# Altium schematic sheet sb-sonata-psu.SchDoc: Switch-mode PSU
size Letter; Organization: NewAE Technology Inc.; Address1: 1083 Queen St., Suite 196; Address2: Halifax; Address3: NS; Address4: Canada B3H 0B2; SheetNumber: 17; SheetTotal: 20; SheetApproved: YES
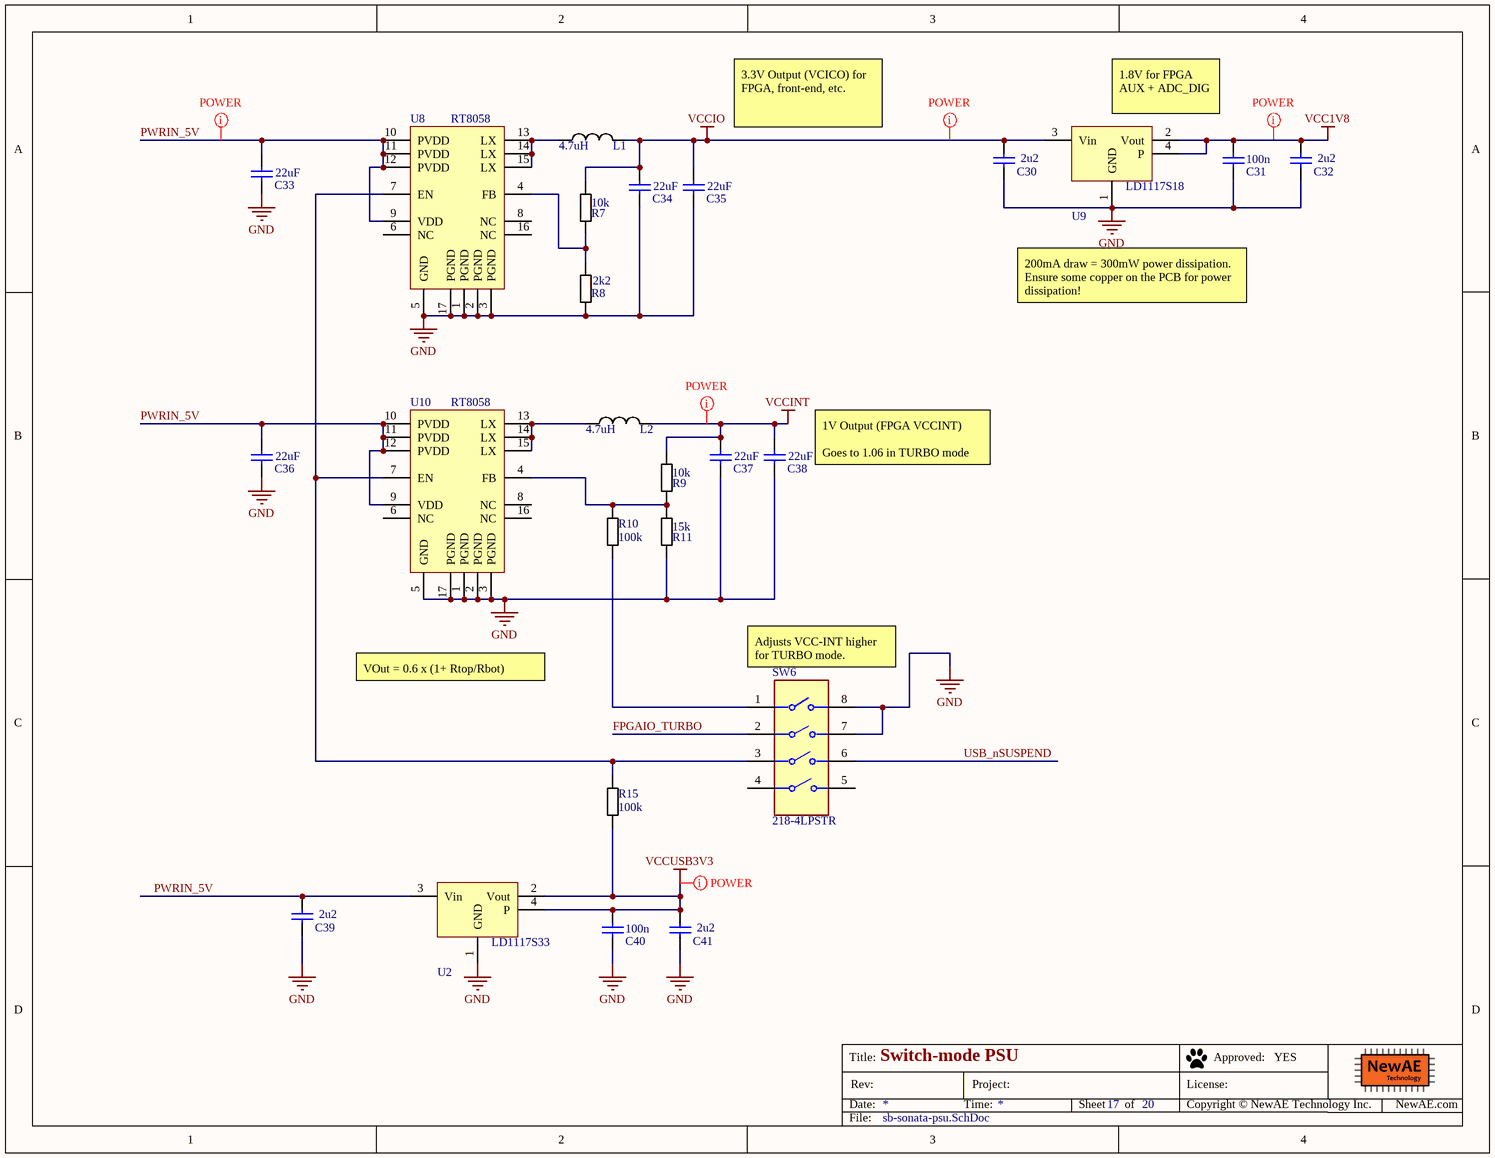
[diagram p0: sb-sonata-psu.SchDoc]

## Parts
C30  2u2  [CAPC0603_M]
C31  100n  [CAPC0402_M]
C32  2u2  [CAPC0603_M]
C33  22uF  [CAPC0805_M]
C34  22uF  [CAPC0805_M]
C35  22uF  [CAPC0805_M]
C36  22uF  [CAPC0805_M]
C37  22uF  [CAPC0805_M]
C38  22uF  [CAPC0805_M]
C39  2u2  [CAPC0603_M]
C40  100n  [CAPC0402_M]
C41  2u2  [CAPC0603_M]
L1  4.7uH  [NR6028]
L2  4.7uH  [NR6028]
R7  10k  [RESC1005X40N]
R8  2k2  [RESC1005X40N]
R9  10k  [RESC1005X40N]
R10  100k  [RESC1005X40N]
R11  15k  [RESC1005X40N]
R15  100k  [RESC1608X55N]
SW6  218-4LPSTR  [FP-218-4LPSTR-MFG]
U2  LD1117S33  [SOT-223]
U8  RT8058  [QFN16_50P300X300X100_HS-17M]
U9  LD1117S18  [SOT-223]
U10  RT8058  [QFN16_50P300X300X100_HS-17M]

## Nets
GND: C30.2 C31.2 C32.2 C33.2 C34.2 C35.2 C36.2 C37.2 C38.2 C39.2 C40.2 C41.2 R8.2 R11.2 SW6.7 SW6.8 U2.1(GND) U8.1(PGND) U8.2(PGND) U8.3(PGND) U8.5(GND) U8.17(PGND) U9.1(GND) U10.1(PGND) U10.2(PGND) U10.3(PGND) U10.5(GND) U10.17(PGND)
VCC1V8: C31.1 C32.1 U9.2(Vout) U9.4(P)
VCCINT: C37.1 C38.1 L2.2 R9.1
VCCIO: C30.1 C34.1 C35.1 L1.2 R7.1 U9.3(Vin)
VCCUSB3V3: C40.1 C41.1 R15.1 U2.2(Vout) U2.4(P)
FPGAIO_TURBO: SW6.2
PWRIN_5V: C33.1 C36.1 C39.1 U2.3(Vin) U8.9(VDD) U8.10(PVDD) U8.11(PVDD) U8.12(PVDD) U10.9(VDD) U10.10(PVDD) U10.11(PVDD) U10.12(PVDD)
USB_nSUSPEND: SW6.6
NetL1_1: L1.1 U8.13(LX) U8.14(LX) U8.15(LX)
NetL2_1: L2.1 U10.13(LX) U10.14(LX) U10.15(LX)
NetR7_2: R7.2 R8.1 U8.4(FB)
NetR9_2: R9.2 R10.1 R11.1 U10.4(FB)
NetR10_2: R10.2 SW6.1
NetR15_2: R15.2 SW6.3 U8.7(EN) U10.7(EN)

Not connected (* = marked no-connect by the designer): SW6 4 5; U8 6(NC) 8(NC) 16(NC); U10 6(NC) 8(NC) 16(NC)

## Layout directives
net class Power: PWRIN_5V, VCC1V8, VCCINT, VCCIO, VCCUSB3V3

## Notes on the sheet
- 3.3V Output (VCICO) for FPGA, front-end, etc.
- 1.8V for FPGA AUX + ADC_DIG
- 200mA draw = 300mW power dissipation. Ensure some copper on the PCB for power dissipation!
- (near C38) 1V Output (FPGA VCCINT)
  Goes to 1.06 in TURBO mode
- VOut = 0.6 x (1+ Rtop/Rbot)
- (near SW6) Adjusts VCC-INT higher for TURBO mode.
- Title:
- Date:
- Rev:
- Time:
- Project:
- Sheet
- of
- License:
- Copyright © NewAE Technology Inc.
- Approved:
- NewAE.com
- File:

## Library data of the parts
C30 C32 C39 C41 = CCHIP-2u2-0603: 2u2, 0603; Manufacture 1: Samsung; Manufacture Part Number 1: CL10B225KP8NNNC; Component Group: Capacitor; Case-EIA: 0603; Case-Metric: 1608; Rated Voltage: 10VDC; Part Number: CCHIP-2u2-0603; Footprint: 0603; Pin Count: 2; Supplier 1: Digi-Key; Supplier Part Number 1: 1276-1134-2-ND; Value: 2u2; Mounting Technology: SMT; Component Kind: Standard; Component Type: Standard
C31 C40 = CCHIP-100n-0402: 100n, 0402; Component Group: Capacitor; Case-EIA: 0402; Part Number: CCHIP-100n-0402; Footprint: 0402; Pin Count: 2; Value: 100n; Mounting Technology: SMT; Component Kind: Standard; Component Type: Standard; Supplier 1: Digi-Key; Supplier Part Number 1: 445-6901-1-ND
C33-C38 = CCHIP-22u-0805-16V: 22u, 16V, 0805, Ceramic; Manufacture 1: Samsung Electro-Mechanics; Manufacture Part Number 1: CL21A226MOCLRNC; Component Group: Capacitor; Case-EIA: 0805; Case-Metric: 1608; Rated Voltage: 16VDC; Tolerance: 20%; Part Number: CCHIP-22u-0805-16V; Footprint: 0805; Pin Count: 2; Supplier 1: Digi-Key; Supplier Part Number 1: 1276-6780-1-ND; Value: 22uF; Mounting Technology: SMT; RoHS: Yes; Component Kind: Standard; Component Type: Standard
L1 L2 = NR6028T4R7M: fixed ind, ferrite, shielded; Manufacture 1: Taiyo Yuden; Component Group: Inductor; Case-Metric: 6060; Part Number: NR6028T4R7M; Footprint: SMD,6x6mm; Manufacture Part Number 1: NR6028T4R7M; Pin Count: 2; Supplier 1: Digi-Key; Supplier Part Number 1: 587-2100-1-ND; Value: 4.7uH; Mounting Technology: SMT; Component Kind: Standard; Component Type: Standard
R7 R9 = RCHIP-10K-0402: 10k res, 0402, 1%, 1/16W; Manufacture 1: Yageo; Manufacture Part Number 1: RC0402FR-0710KL; Component Group: Resistor; Case-EIA: 0402; Case-Metric: 1005; Rated Power: 0.063W; Rated Voltage: 75VDC; Part Number: RCHIP-10K-0402; Footprint: 0402; Pin Count: 2; Supplier 1: Digi-Key; Supplier Part Number 1: 311-10.0KLRCT-ND; Value: 10k; Tolerance: 1%; Mounting Technology: SMT; Temperature Range: -55C to 155C; Component Kind: Standard; Component Type: Standard
R8 = RCHIP-2K2-0402: 2k2 res, 0402, 1%, 1/16W; Manufacture 1: Yageo; Manufacture Part Number 1: RC0402FR-072K2L; Component Group: Resistor; Case-EIA: 0402; Case-Metric: 1005; Rated Power: 0.063W; Rated Voltage: 75VDC; Part Number: RCHIP-2K2-0402; Footprint: 0402; Pin Count: 2; Supplier 1: Digi-Key; Supplier Part Number 1: 311-2.20KLRCT-ND; Value: 2k2; Tolerance: 1%; Mounting Technology: SMT; Temperature Range: -55C to 155C; Component Kind: Standard; Component Type: Standard
R10 = RCHIP-100K-0402: 100k res, 0402, 1%, 1/16W; Manufacture 1: Yageo; Manufacture Part Number 1: RC0402FR-07100KL; Component Group: Resistor; Case-EIA: 0402; Case-Metric: 1005; Rated Power: 0.063W; Rated Voltage: 75VDC; Part Number: RCHIP-100K-0402; Footprint: 0402; Pin Count: 2; Supplier 1: Digi-Key; Supplier Part Number 1: 311-100KLRCT-ND; Value: 100k; Tolerance: 1%; Mounting Technology: SMT; Temperature Range: -55C to 155C; Component Kind: Standard; Component Type: Standard
R11 = RCHIP-15K-0402: 15k res, 0402, 1%, 1/16W; Manufacture 1: Yageo; Manufacture Part Number 1: RC0402FR-0715KL; Component Group: Resistor; Case-EIA: 0402; Case-Metric: 1005; Rated Power: 0.063W; Rated Voltage: 75VDC; Part Number: RCHIP-15K-0402; Footprint: 0402; Pin Count: 2; Supplier 1: Digi-Key; Supplier Part Number 1: 311-15.0KLRCT-ND; Value: 15k; Tolerance: 1%; Mounting Technology: SMT; Temperature Range: -55C to 155C; Component Kind: Standard; Component Type: Standard
R15 = RCHIP-100K-0603: 100k res, 0603, 1%, 1/10W; Manufacture 1: Yageo; Manufacture Part Number 1: RC0603FR-07100KL; Component Group: Resistor; Case-EIA: 0603; Case-Metric: 1608; Rated Power: 0.1W; Rated Voltage: 75VDC; Part Number: RCHIP-100K-0603; Footprint: 0603; Pin Count: 2; Supplier 1: Digi-Key; Supplier Part Number 1: 311-100KHRCT-ND; Value: 100k; Tolerance: 1%; Mounting Technology: SMT; Temperature Range: -55C to 155C; Component Kind: Standard; Component Type: Standard
SW6 = CMP-07018-000008-1: SWITCH SLIDE DIP SPST 25MA 24V; Number of Positions: 4; Washable: Yes; Pitch: 0.05inch; Actuator Type: Slide (Standard); Electrical Life: 1000Cycles; Current Rating: 25mA; Contact Material: Copper; Max Current Rating: 25mA; Termination: Gull Wing; Throw Configuration: SPST; Mount: Surface Mount; Radiation Hardening: No; Contact Plating: Gold; Length: 0.246inch; Depth: 8.44mm; Package Quantity: 2000; Packaging: Tape and Reel; Series: 218; Lead Free: Lead Free; Voltage Rating (DC): 24V; Min Operating Temperature: -55°C; RoHS Compliant: Yes; Mechanical Life: 1000Cycles; Max Operating Temperature: 85°C; Orientation: Straight; Max Voltage Rating (DC): 24V
U2 = LD1117S33: IC REG LIN POS 3.3V 800MA SOT223; Manufacture 1: STMicroelectronics; Manufacture Part Number 1: LD1117S33TR; Component Group: Analog IC; Rated Voltage: 15V; PP Material Stack: 0; Part Number: LD1117S33; Pin Count: 3; Supplier 1: Digi-Key; Supplier Part Number 1: 497-1242-1-ND; Mounting Technology: SMT; RoHS: Yes; Component Kind: Standard; Component Type: Standard; PP Rotation: 0
U8 U10 = RT8058: Switching supply controller, 2A; Manufacture 1: Richtek; Component Group: Analog IC; PP Material Stack: 0; Part Number: RT8058; Footprint: QFN16; Manufacture Part Number 1: RT8058; Pin Count: 17; Component Kind: Standard; Component Type: Standard; PP Rotation: 0
U9 = LD1117S18: IC REG LIN POS 1.8V 800MA SOT223; Manufacture 1: STMicroelectronics; Manufacture Part Number 1: LD1117S18TR; Component Group: Analog IC; Rated Voltage: 15V; PP Material Stack: 0; Part Number: LD1117S18; Pin Count: 3; Supplier 1: Digi-Key; Supplier Part Number 1: 497-7308-1-ND; Mounting Technology: SMT; RoHS: Yes; Component Kind: Standard; Component Type: Standard; PP Rotation: 0